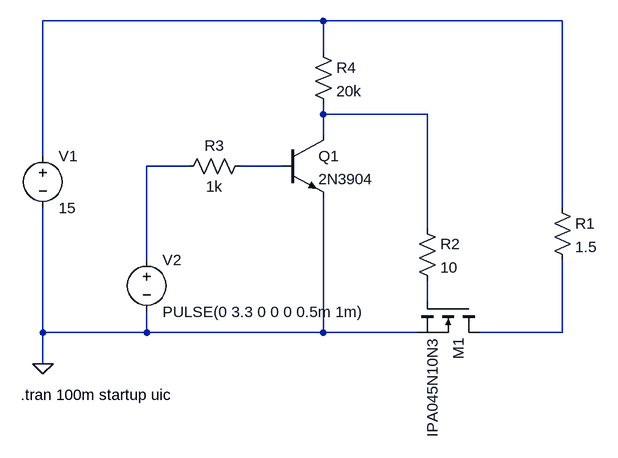
[diagram p0: schematic bjt-mosfet-drive.asc]
bjt-mosfet-drive.asc, the LTspice schematic file:
Version 4
SHEET 1 880 680
WIRE 224 -160 -208 -160
WIRE 592 -160 224 -160
WIRE 224 -112 224 -160
WIRE 224 -16 224 -32
WIRE 384 -16 224 -16
WIRE 224 16 224 -16
WIRE -208 48 -208 -160
WIRE 16 64 -48 64
WIRE 160 64 96 64
WIRE 592 128 592 -160
WIRE 384 160 384 -16
WIRE -48 208 -48 64
WIRE 384 272 384 240
WIRE -208 320 -208 128
WIRE -48 320 -48 288
WIRE -48 320 -208 320
WIRE 224 320 224 112
WIRE 224 320 -48 320
WIRE 368 320 224 320
WIRE 592 320 592 208
WIRE 592 320 464 320
WIRE -208 368 -208 320
FLAG -208 368 0
SYMBOL npn 160 16 R0
SYMATTR InstName Q1
SYMATTR Value 2N3904
SYMBOL nmos 464 272 R90
SYMATTR InstName M1
SYMATTR Value IPA045N10N3
SYMBOL voltage -208 32 R0
WINDOW 123 0 0 Left 2
WINDOW 39 0 0 Left 2
SYMATTR InstName V1
SYMATTR Value 15
SYMBOL voltage -48 192 R0
WINDOW 123 0 0 Left 2
WINDOW 39 0 0 Left 2
SYMATTR InstName V2
SYMATTR Value PULSE(0 3.3 0 0 0 0.5m 1m)
SYMBOL res 576 112 R0
SYMATTR InstName R1
SYMATTR Value 1.5
SYMBOL res 368 144 R0
SYMATTR InstName R2
SYMATTR Value 10
SYMBOL res 112 48 R90
WINDOW 0 0 56 VBottom 2
WINDOW 3 32 56 VTop 2
SYMATTR InstName R3
SYMATTR Value 1k
SYMBOL res 208 -128 R0
SYMATTR InstName R4
SYMATTR Value 20k
TEXT -242 416 Left 2 !.tran 100m startup uic

The netlist it stands for:
* bjt-mosfet-drive.asc
Q1 N002 N004 0 0 2N3904
M1 N006 N005 0 0 IPA045N10N3
V1 N001 0 15
V2 N003 0 PULSE(0 3.3 0 0 0 0.5m 1m)
R1 N001 N006 1.5
R2 N002 N005 10
R3 N004 N003 1k
R4 N001 N002 20k
.model NPN NPN
.model PNP PNP
.lib standard.bjt
.model NMOS NMOS
.model PMOS PMOS
.lib standard.mos
.tran 100m startup uic
.backanno
.end